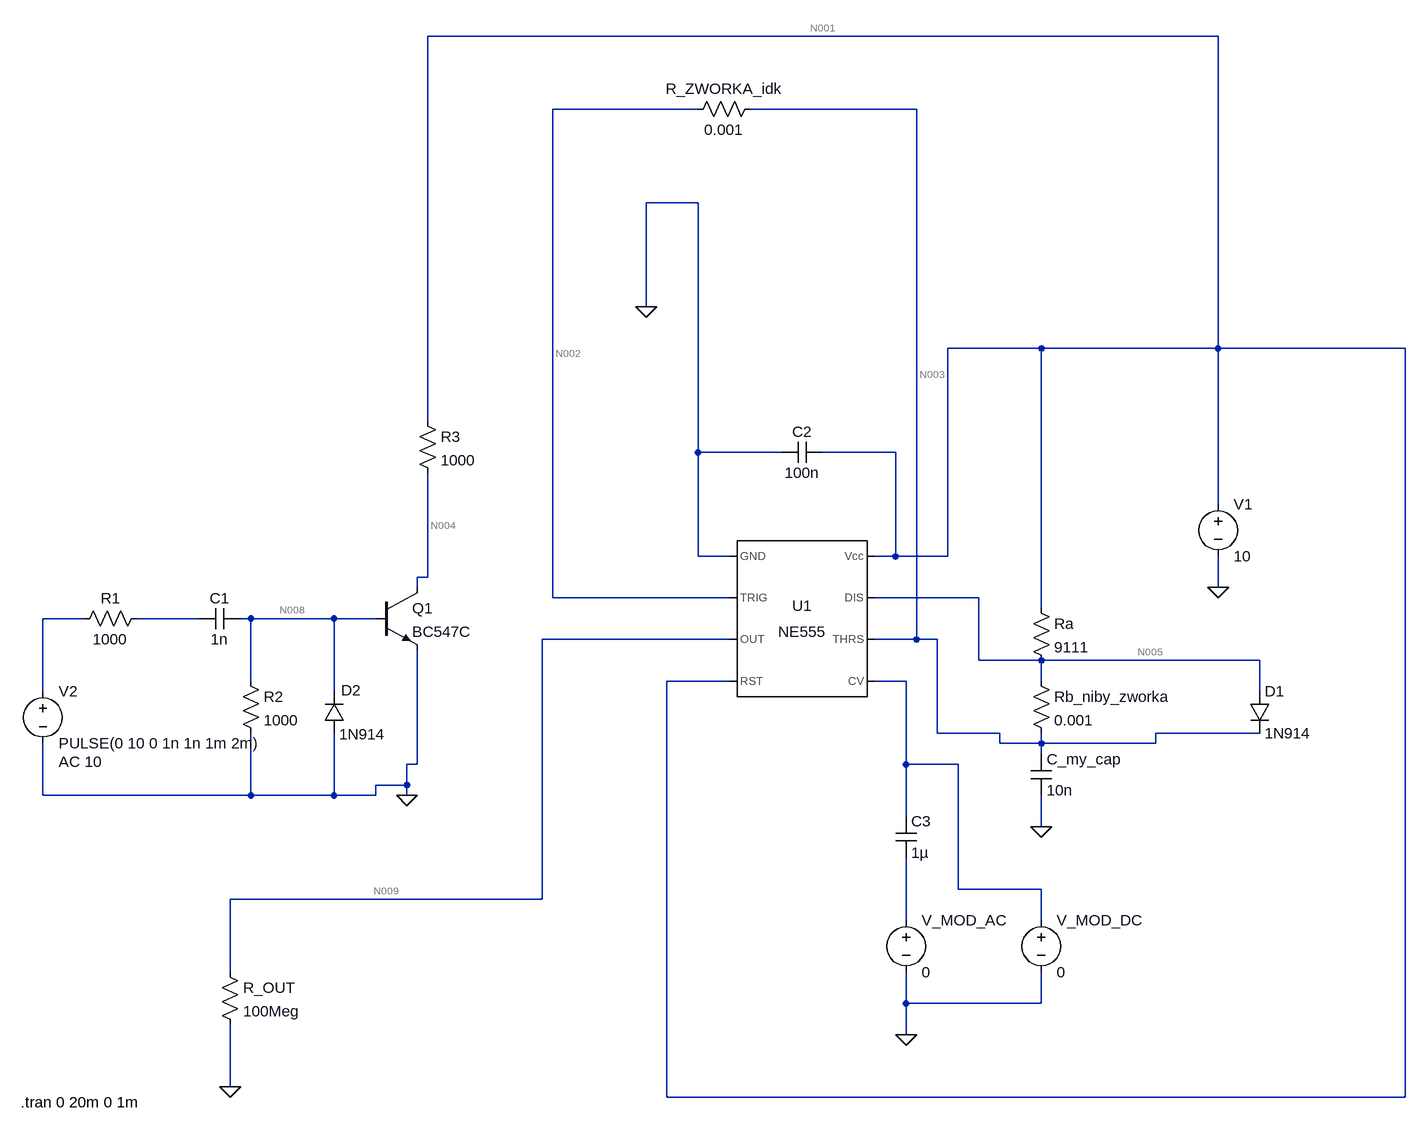
[diagram p0: schematic Draft2.asc]
Draft2.asc, the LTspice schematic file:
Version 4
SHEET 1 1120 936
WIRE 816 -720 -400 -720
WIRE 16 -608 -208 -608
WIRE 352 -608 96 -608
WIRE 16 -464 -64 -464
WIRE -64 -304 -64 -464
WIRE 544 -240 400 -240
WIRE 816 -240 816 -720
WIRE 816 -240 544 -240
WIRE 1104 -240 816 -240
WIRE -400 -128 -400 -720
WIRE 16 -80 16 -464
WIRE 144 -80 16 -80
WIRE 320 -80 208 -80
WIRE 816 0 816 -240
WIRE 16 80 16 -80
WIRE 64 80 16 80
WIRE 320 80 320 -80
WIRE 320 80 288 80
WIRE 400 80 400 -240
WIRE 400 80 320 80
WIRE -400 112 -400 -48
WIRE -400 112 -416 112
WIRE -416 128 -416 112
WIRE 816 128 816 80
WIRE -208 144 -208 -608
WIRE 64 144 -208 144
WIRE 448 144 288 144
WIRE 544 160 544 -240
WIRE -928 176 -992 176
WIRE -752 176 -848 176
WIRE -672 176 -688 176
WIRE -544 176 -672 176
WIRE -480 176 -544 176
WIRE 64 208 -224 208
WIRE 352 208 352 -608
WIRE 352 208 288 208
WIRE 384 208 352 208
WIRE 448 240 448 144
WIRE 544 240 448 240
WIRE 880 240 544 240
WIRE -672 272 -672 176
WIRE 64 272 -32 272
WIRE 336 272 288 272
WIRE 544 272 544 240
WIRE -992 288 -992 176
WIRE -544 288 -544 176
WIRE 880 288 880 240
WIRE 384 352 384 208
WIRE 480 352 384 352
WIRE 880 352 720 352
WIRE 480 368 480 352
WIRE 544 368 544 352
WIRE 544 368 480 368
WIRE 720 368 720 352
WIRE 720 368 544 368
WIRE 544 384 544 368
WIRE -416 400 -416 224
WIRE -416 400 -432 400
WIRE 336 400 336 272
WIRE 416 400 336 400
WIRE -432 432 -432 400
WIRE -432 432 -480 432
WIRE -992 448 -992 368
WIRE -672 448 -672 352
WIRE -672 448 -992 448
WIRE -544 448 -544 352
WIRE -544 448 -672 448
WIRE -480 448 -480 432
WIRE -480 448 -544 448
WIRE -432 448 -432 432
WIRE 336 480 336 400
WIRE 544 496 544 448
WIRE 416 592 416 400
WIRE 544 592 416 592
WIRE -224 608 -224 208
WIRE -224 608 -704 608
WIRE 336 640 336 544
WIRE 544 640 544 592
WIRE -704 720 -704 608
WIRE 336 768 336 720
WIRE 544 768 544 720
WIRE 544 768 336 768
WIRE 336 816 336 768
WIRE -704 896 -704 800
WIRE -32 912 -32 272
WIRE 1104 912 1104 -240
WIRE 1104 912 -32 912
FLAG -64 -304 0
FLAG 336 816 0
FLAG 544 496 0
FLAG 816 128 0
FLAG -432 448 0
FLAG -704 896 0
SYMBOL Misc\\NE555 176 176 R0
SYMATTR InstName U1
SYMBOL voltage 816 -16 R0
WINDOW 123 0 0 Left 0
WINDOW 39 0 0 Left 0
SYMATTR InstName V1
SYMATTR Value 10
SYMBOL voltage -992 272 R0
WINDOW 123 24 124 Left 2
WINDOW 39 0 0 Left 0
SYMATTR InstName V2
SYMATTR Value PULSE(0 10 0 1n 1n 1m 2m)
SYMATTR Value2 AC 10
SYMBOL cap 208 -96 R90
WINDOW 0 0 32 VBottom 2
WINDOW 3 32 32 VTop 2
SYMATTR InstName C2
SYMATTR Value 100n
SYMBOL res 528 144 R0
SYMATTR InstName Ra
SYMATTR Value 9111
SYMBOL res 528 256 R0
SYMATTR InstName Rb_niby_zworka
SYMATTR Value 0.001
SYMBOL cap 320 480 R0
SYMATTR InstName C3
SYMATTR Value 1µ
SYMBOL voltage 336 624 R0
WINDOW 123 0 0 Left 0
WINDOW 39 0 0 Left 0
SYMATTR InstName V_MOD_AC
SYMATTR Value 0
SYMBOL voltage 544 624 R0
SYMATTR InstName V_MOD_DC
SYMATTR Value 0
SYMBOL cap 528 384 R0
SYMATTR InstName C_my_cap
SYMATTR Value 10n
SYMBOL diode 864 288 R0
SYMATTR InstName D1
SYMATTR Value 1N914
SYMBOL res 112 -624 R90
WINDOW 0 0 56 VBottom 2
WINDOW 3 32 56 VTop 2
SYMATTR InstName R_ZWORKA_idk
SYMATTR Value 0.001
SYMBOL res -720 704 R0
SYMATTR InstName R_OUT
SYMATTR Value 100Meg
SYMBOL res -832 160 R90
WINDOW 0 0 56 VBottom 2
WINDOW 3 32 56 VTop 2
SYMATTR InstName R1
SYMATTR Value 1000
SYMBOL cap -688 160 R90
WINDOW 0 0 32 VBottom 2
WINDOW 3 32 32 VTop 2
SYMATTR InstName C1
SYMATTR Value 1n
SYMBOL diode -528 352 R180
WINDOW 0 -26 66 Left 2
WINDOW 3 -63 -2 Left 2
SYMATTR InstName D2
SYMATTR Value 1N914
SYMBOL res -688 256 R0
SYMATTR InstName R2
SYMATTR Value 1000
SYMBOL npn -480 128 R0
SYMATTR InstName Q1
SYMATTR Value BC547C
SYMBOL res -416 -144 R0
SYMATTR InstName R3
SYMATTR Value 1000
TEXT -1026 920 Left 2 !.tran 0 20m 0 1m

The netlist it stands for:
* Draft2.asc
XU1 0 N002 N009 N001 N010 N003 N005 N001 NE555  ; pins GND TRIG OUT RST CV THRS DIS Vcc
V1 N001 0 10
V2 N006 0 PULSE(0 10 0 1n 1n 1m 2m) AC 10
C2 N001 0 100n
Ra N001 N005 9111
Rb_niby_zworka N005 N003 0.001
C3 N010 N011 1µ
V_MOD_AC N011 0 0
V_MOD_DC N010 0 0
C_my_cap N003 0 10n
D1 N005 N003 1N914
R_ZWORKA_idk N003 N002 0.001
R_OUT N009 0 100Meg
R1 N007 N006 1000
C1 N008 N007 1n
D2 0 N008 1N914
R2 N008 0 1000
Q1 N004 N008 0 0 BC547C
R3 N001 N004 1000
.model D D
.lib standard.dio
.model NPN NPN
.model PNP PNP
.lib standard.bjt
.tran 0 20m 0 1m
.lib NE555.sub
.backanno
.end

* Results of the author's LTspice run, read from the files saved beside the schematic
* Operating Point, zero values left out:
*   V(n002) = 10 V
*   V(n001) = 10 V
*   V(n005) = 10 V
*   V(n003) = 10 V
*   V(n009) = 10 V
*   V(n008) = 10.03 nV
*   V(n004) = 10 V
*   Ic(Q1) = 10.08 pA
*   Ib(Q1) = -10.03 pA
*   I(R3) = 10.08 pA
*   I(R2) = 10.03 pA
*   I(R_out) = 100 nA
*   I(R_zworka_idk) = 10 nA
*   I(Rb_niby_zworka) = 20 nA
*   I(Ra) = 33.35 nA
*   I(V_mod_dc) = 2 mA
*   I(V1) = -4.566 mA
*   Ix(u1:1) = -2.566 mA
*   Ix(u1:2) = 10 nA
*   Ix(u1:3) = -100 nA
*   Ix(u1:4) = 56 µA
*   Ix(u1:5) = -2 mA
*   Ix(u1:6) = 10 nA
*   Ix(u1:7) = 13.34 nA
*   Ix(u1:8) = 4.51 mA
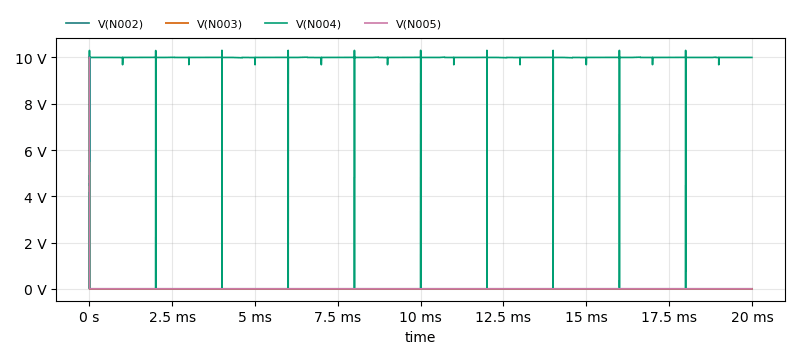
[diagram p1: Transient Analysis of Draft2.asc, plotted from the saved traces]
* Transient Analysis, 1 run:
*   V(N002): min 6.581 mV, max 10 V, average 6.683 mV, rms 30.18 mV, last 6.581 mV
*   V(N003): min 6.581 mV, max 10 V, average 6.683 mV, rms 30.18 mV, last 6.581 mV
*   V(N004): min 17.35 mV, max 10.31 V, average 9.986 V, rms 9.993 V, last 10 V
*   V(N005): min 6.581 mV, max 10 V, average 6.683 mV, rms 30.24 mV, last 6.581 mV